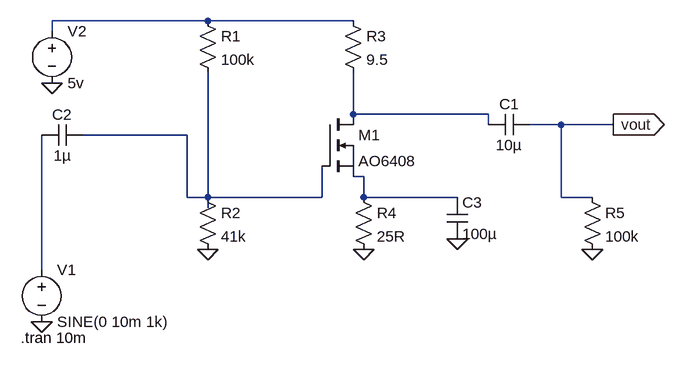
[diagram p0: schematic NNM24EE010_AkshayGRao.asc]
NNM24EE010_AkshayGRao.asc, the LTspice schematic file:
Version 4
SHEET 1 880 680
WIRE 144 16 -96 16
WIRE 368 16 144 16
WIRE -96 32 -96 16
WIRE 368 160 368 96
WIRE 576 160 368 160
WIRE 576 176 576 160
WIRE 688 176 640 176
WIRE 768 176 688 176
WIRE 112 192 -48 192
WIRE 384 256 368 256
WIRE 112 288 112 192
WIRE 144 288 144 96
WIRE 144 288 112 288
WIRE 320 288 320 240
WIRE 320 288 144 288
WIRE 384 288 384 256
WIRE 528 288 384 288
WIRE 688 288 688 176
WIRE 736 288 688 288
WIRE 144 304 144 288
WIRE -112 400 -112 192
FLAG 144 368 0
FLAG 384 368 0
FLAG 528 352 0
FLAG 736 368 0
FLAG -96 112 0
FLAG -112 480 0
FLAG 768 176 vout
IOPIN 768 176 Out
SYMBOL res 128 0 R0
SYMATTR InstName R1
SYMATTR Value 100k
SYMBOL res 128 272 R0
SYMATTR InstName R2
SYMATTR Value 41k
SYMBOL res 352 0 R0
SYMATTR InstName R3
SYMATTR Value 9.5
SYMBOL res 368 272 R0
SYMATTR InstName R4
SYMATTR Value 25R
SYMBOL res 720 272 R0
SYMATTR InstName R5
SYMATTR Value 100k
SYMBOL nmos 320 160 R0
SYMATTR InstName M1
SYMATTR Value AO6408
SYMBOL cap 640 160 R90
WINDOW 0 0 32 VBottom 2
WINDOW 3 32 32 VTop 2
SYMATTR InstName C1
SYMATTR Value 10µ
SYMBOL cap -48 176 R90
WINDOW 0 0 32 VBottom 2
WINDOW 3 32 32 VTop 2
SYMATTR InstName C2
SYMATTR Value 1µ
SYMBOL cap 512 288 R0
SYMATTR InstName C3
SYMATTR Value 100µ
SYMBOL voltage -96 16 R0
WINDOW 123 0 0 Left 0
WINDOW 39 0 0 Left 0
SYMATTR InstName V2
SYMATTR Value 5v
SYMBOL voltage -112 384 R0
WINDOW 123 0 0 Left 0
WINDOW 39 0 0 Left 0
SYMATTR InstName V1
SYMATTR Value SINE(0 10m 1k)
TEXT -144 504 Left 2 !.tran 10m

The netlist it stands for:
* NNM24EE010_AkshayGRao.asc
R1 N001 N003 100k
R2 N003 0 41k
R3 N001 N002 9.5
R4 N004 0 25R
R5 vout 0 100k
M1 N002 N003 N004 N004 AO6408
C1 vout N002 10µ
C2 N003 N005 1µ
C3 N004 0 100µ
V2 N001 0 5v
V1 N005 0 SINE(0 10m 1k)
.model NMOS NMOS
.model PMOS PMOS
.lib standard.mos
.tran 10m
.backanno
.end